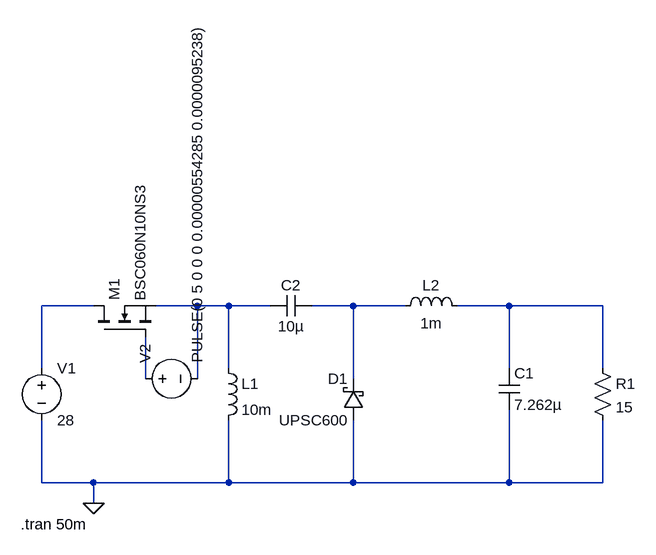
[diagram p0: schematic zeta_circuit.asc]
zeta_circuit.asc, the LTspice schematic file:
Version 4
SHEET 1 880 680
WIRE -32 0 -112 0
WIRE 128 0 64 0
WIRE 176 0 128 0
WIRE 240 0 176 0
WIRE 368 0 304 0
WIRE 448 0 368 0
WIRE 608 0 528 0
WIRE 752 0 608 0
WIRE -112 96 -112 0
WIRE 176 96 176 0
WIRE 608 96 608 0
WIRE 752 96 752 0
WIRE 48 112 48 48
WIRE 128 112 128 0
WIRE 368 112 368 0
WIRE -112 272 -112 176
WIRE -32 272 -112 272
WIRE 176 272 176 176
WIRE 176 272 -32 272
WIRE 368 272 368 176
WIRE 368 272 176 272
WIRE 608 272 608 160
WIRE 608 272 368 272
WIRE 752 272 752 176
WIRE 752 272 608 272
WIRE -32 304 -32 272
FLAG -32 304 0
SYMBOL voltage -112 80 R0
WINDOW 123 0 0 Left 0
WINDOW 39 0 0 Left 0
SYMATTR InstName V1
SYMATTR Value 28
SYMBOL ind 160 80 R0
SYMATTR InstName L1
SYMATTR Value 10m
SYMBOL cap 592 96 R0
SYMATTR InstName C1
SYMATTR Value 7.262µ
SYMBOL res 736 80 R0
SYMATTR InstName R1
SYMATTR Value 15
SYMBOL voltage 32 112 R270
WINDOW 123 0 0 Left 0
WINDOW 39 0 0 Left 0
SYMATTR InstName V2
SYMATTR Value PULSE(0 5 0 0 0 0.00000554285 0.0000095238)
SYMBOL schottky 384 176 R180
WINDOW 0 24 64 Left 2
WINDOW 3 24 0 Left 2
SYMATTR InstName D1
SYMATTR Value UPSC600
SYMATTR Description Diode
SYMATTR Type diode
SYMBOL nmos -32 48 R270
SYMATTR InstName M1
SYMATTR Value BSC060N10NS3
SYMBOL cap 304 -16 R90
WINDOW 0 0 32 VBottom 2
WINDOW 3 32 32 VTop 2
SYMATTR InstName C2
SYMATTR Value 10µ
SYMBOL ind 432 16 R270
WINDOW 0 32 56 VTop 2
WINDOW 3 5 56 VBottom 2
SYMATTR InstName L2
SYMATTR Value 1m
TEXT -144 336 Left 2 !.tran 50m

The netlist it stands for:
* zeta_circuit.asc
V1 N001 0 28
L1 N002 0 10m
C1 N004 0 7.262µ
R1 N004 0 15
V2 N005 N002 PULSE(0 5 0 0 0 0.00000554285 0.0000095238)
D1 0 N003 UPSC600
M1 N001 N005 N002 N002 BSC060N10NS3
C2 N003 N002 10µ
L2 N003 N004 1m
.model D D
.lib standard.dio
.model NMOS NMOS
.model PMOS PMOS
.lib standard.mos
.tran 50m
.backanno
.end